# Altium schematic sheet wled-tube.SchDoc
size A3; DocumentNumber: 1; SheetNumber: 1; SheetTotal: 2
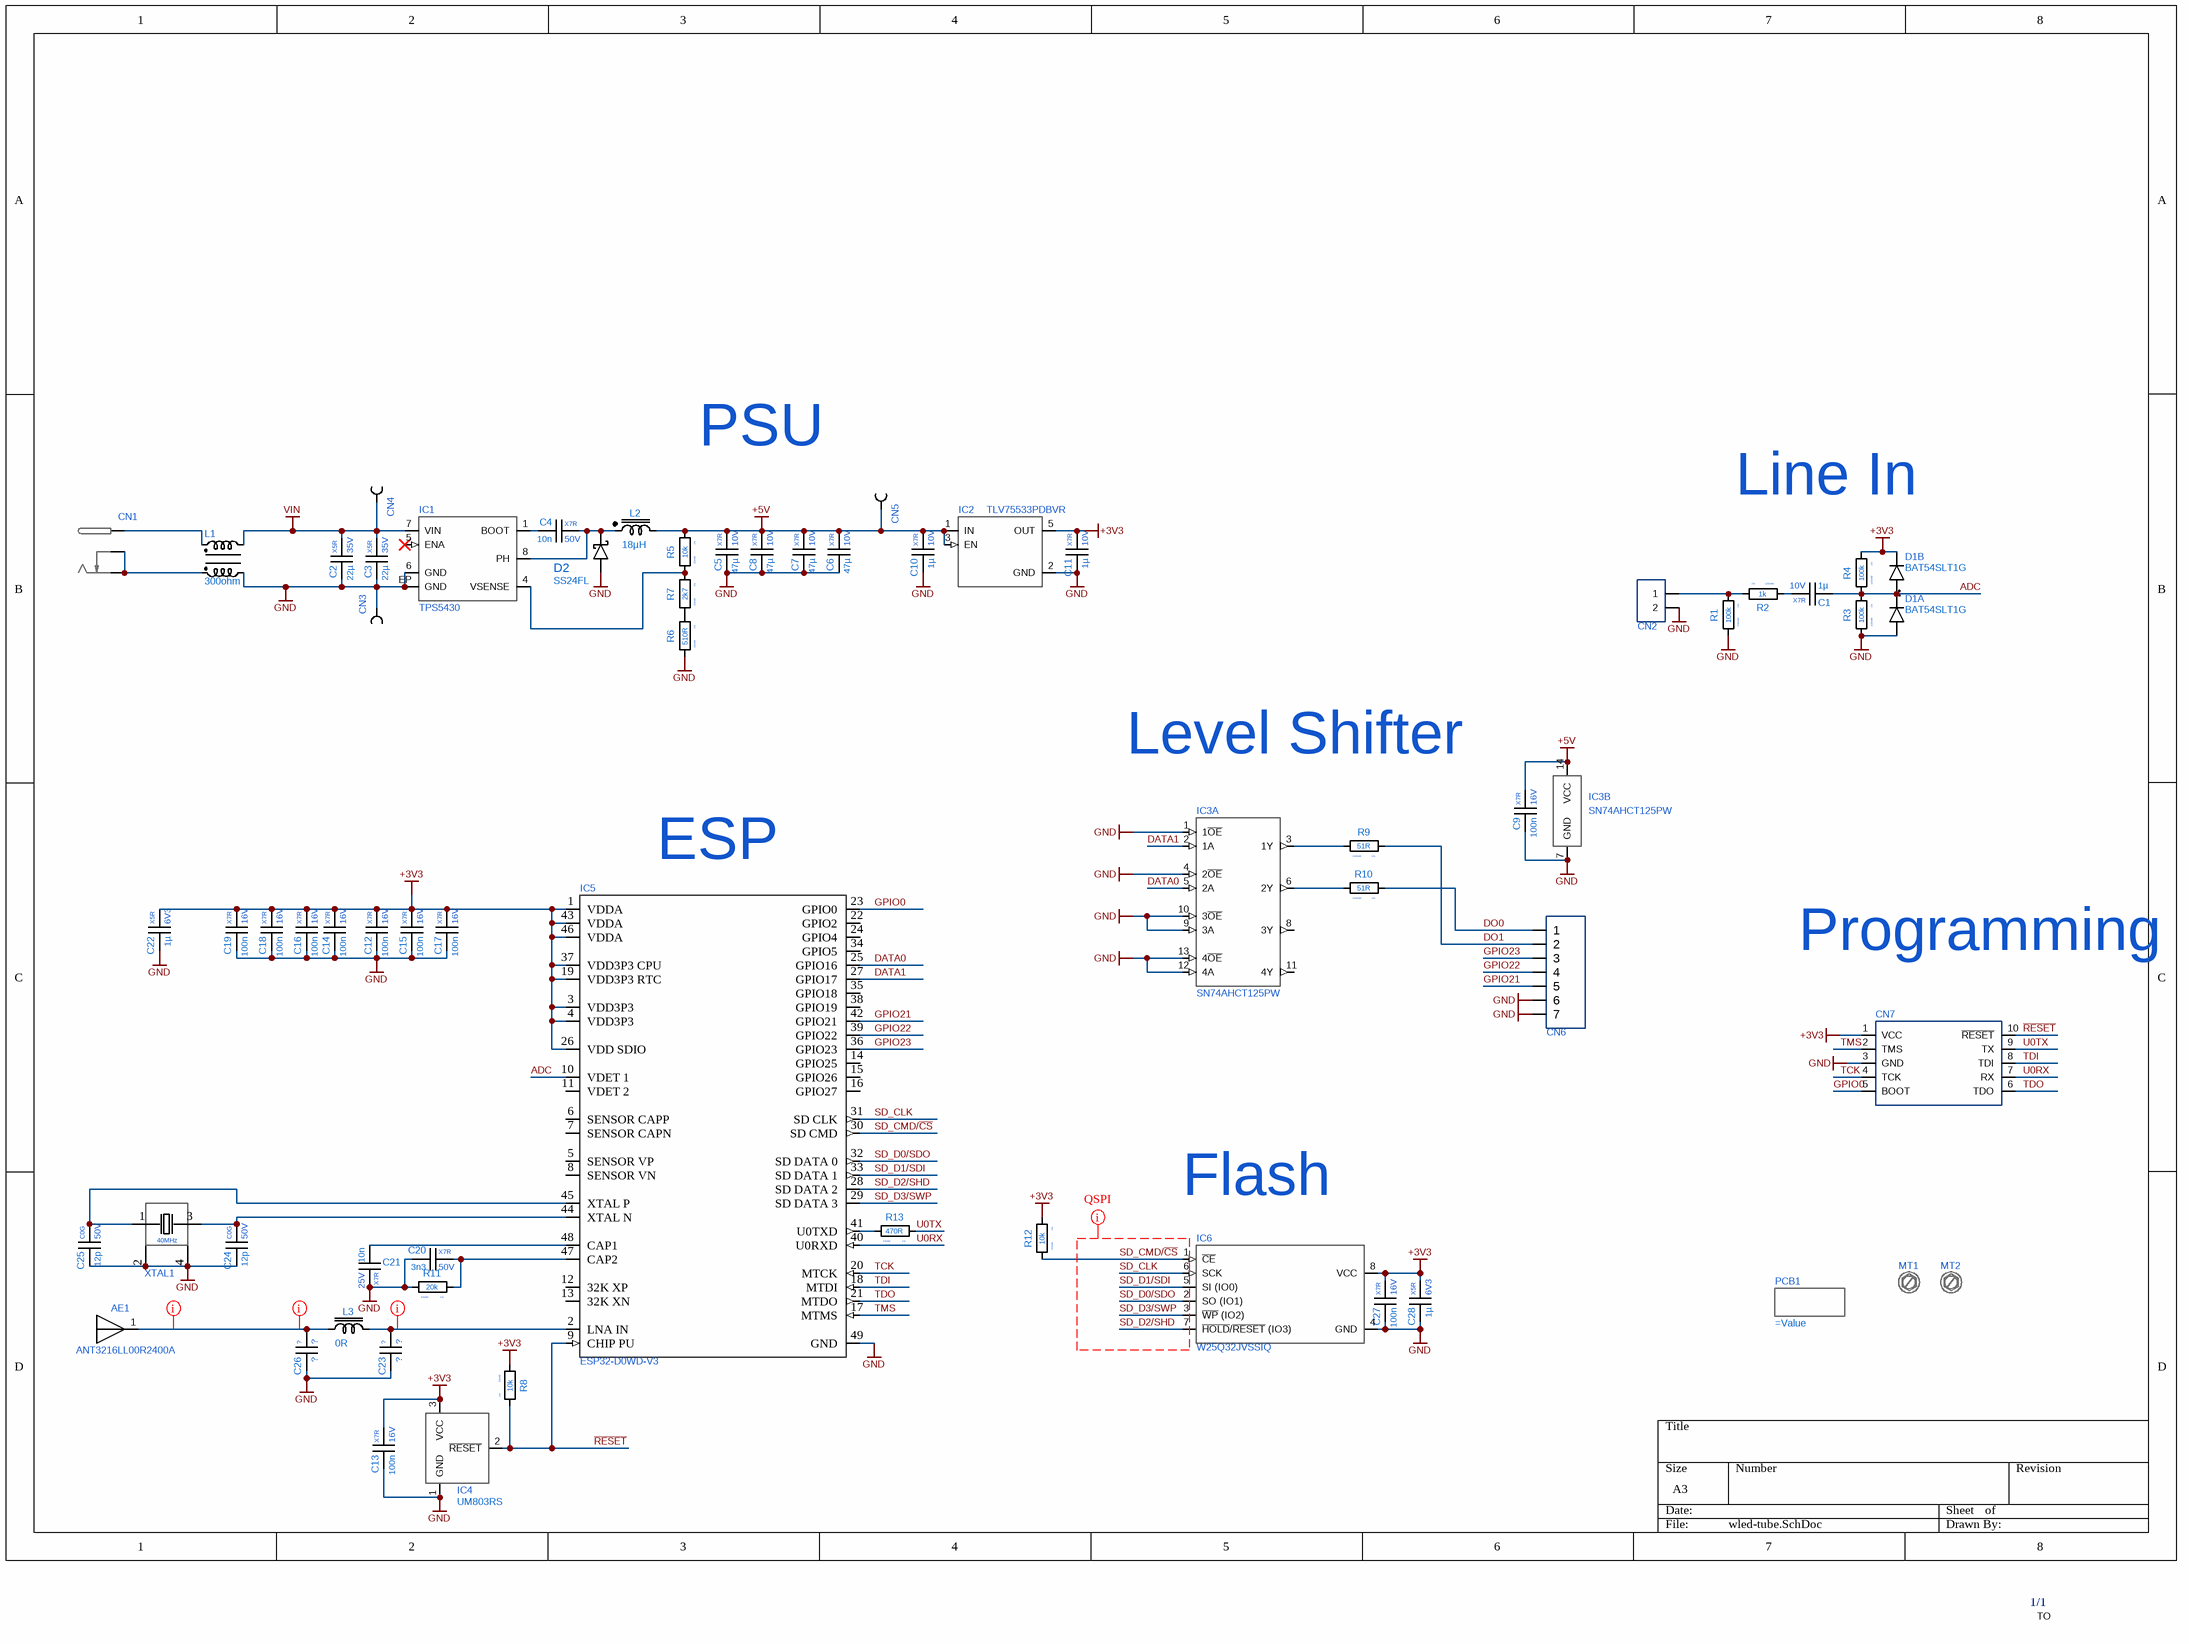
[diagram p0: wled-tube.SchDoc]

## Parts
AE1  ANT3216LL00R2400A  [1206-ANT]
C1  1µ  _P2: X7R  _P1: 10V  [0603-CAP]
C2  22µ  _P2: X5R  _P1: 35V  [1210-CAP]
C3  22µ  _P2: X5R  _P1: 35V  [1210-CAP]
C4  10n  _P2: X7R  _P1: 50V  [0603-CAP]
C5  47µ  _P2: X7R  _P1: 10V  [1210-CAP]
C6  47µ  _P2: X7R  _P1: 10V  [1210-CAP]
C7  47µ  _P2: X7R  _P1: 10V  [1210-CAP]
C8  47µ  _P2: X7R  _P1: 10V  [1210-CAP]
C9  100n  _P2: X7R  _P1: 16V  [0402-CAP]
C10  1µ  _P2: X7R  _P1: 10V  [0603-CAP]
C11  1µ  _P2: X7R  _P1: 10V  [0603-CAP]
C12  100n  _P2: X7R  _P1: 16V  [0402-CAP]
C13  100n  _P2: X7R  _P1: 16V  [0402-CAP]
C14  100n  _P2: X7R  _P1: 16V  [0402-CAP]
C15  100n  _P2: X7R  _P1: 16V  [0402-CAP]
C16  100n  _P2: X7R  _P1: 16V  [0402-CAP]
C17  100n  _P2: X7R  _P1: 16V  [0402-CAP]
C18  100n  _P2: X7R  _P1: 16V  [0402-CAP]
C19  100n  _P2: X7R  _P1: 16V  [0402-CAP]
C20  3n3  _P2: X7R  _P1: 50V  [0402-CAP]
C21  10n  _P2: X7R  _P1: 25V  [0402-CAP]
C22  1µ  _P2: X5R  _P1: 6V3  [0402-CAP]
C23  ?  [0402-CAP]
C24  12p  _P2: C0G  _P1: 50V  [0402-CAP]
C25  12p  _P2: C0G  _P1: 50V  [0402-CAP]
C26  ?  [0402-CAP]
C27  100n  _P2: X7R  _P1: 16V  [0402-CAP]
C28  1µ  _P2: X5R  _P1: 6V3  [0402-CAP]
CN1  (no value)  [DCJACK-1]
CN2  CON-HDR-MALE-2.54MM-1x2-VERT-THT  [CON-HDR-MALE-2.54MM-1x2-VERT-THT]  (value not drawn)
CN3  PAD1.3MM  [PAD1MM3]  (value not drawn)  (no BOM)
CN4  PAD1.3MM  [PAD1MM3]  (value not drawn)  (no BOM)
CN5  PAD1.3MM  [PAD1MM3]  (value not drawn)  (no BOM)
CN6  CON-HDR-MALE-2.54MM-1x7-VERT-THT  [CON-HDR-MALE-2.54MM-1x7-VERT-THT]  (value not drawn)
CN7  TC2050_RASE  [TC2050]  (value not drawn)  (no BOM)
D1  BAT54SLT1G  [SOT-23]  (parts A,B of 2)
D2  SS24FL  [SMAF]
IC1  TPS5430  [TPS5430]
IC2  TLV75533PDBVR  [SOT-23-5]
IC3  SN74AHCT125PW  [TSSOP14]  (parts A,B of 2)
IC4  UM803RS  [SOT-23]
IC5  ESP32-D0WD-V3  [ESP32-D0WD-V3]
IC6  W25Q32JVSSIQ  [SO-08L]
L1  300ohm  [COILCMACM7060]
L2  18µH  [COILSRN8040]
L3  0R  [0402-IND]
MT1  *  [SCRW3MM]  (value not drawn)  (no BOM)
MT2  *  [SCRW3MM]  (value not drawn)  (no BOM)
PCB1  (no value)  [PCB]
R1  100k  _P2: 1%  _P1: 100mW  [0603-RES]
R2  1k  _P2: 1%  _P1: 100mW  [0603-RES]
R3  100k  _P2: 1%  _P1: 100mW  [0603-RES]
R4  100k  _P2: 1%  _P1: 100mW  [0603-RES]
R5  10k  _P2: 1%  _P1: 63mW  [0402-RES]
R6  510R  _P2: 1%  _P1: 63mW  [0402-RES]
R7  2k7  _P2: 1%  _P1: 63mW  [0402-RES]
R8  10k  _P2: 1%  _P1: 63mW  [0402-RES]
R9  51R  _P2: 1%  _P1: 100mW  [0603-RES]
R10  51R  _P2: 1%  _P1: 100mW  [0603-RES]
R11  20k  _P2: 1%  _P1: 63mW  [0402-RES]
R12  10k  _P2: 1%  _P1: 63mW  [0402-RES]
R13  470R  _P2: 1%  _P1: 63mW  [0402-RES]
XTAL1  Frequency: 40MHz  [TSX-3225]  (hidden comment: TSX-3225 40.0000MF10Y-K0)

## Nets
+3V3: C11.2 C12.2 C13.2 C14.2 C15.2 C16.2 C17.2 C18.2 C19.2 C22.2 C27.2 C28.2 CN7.1(VCC) D1.2(K) IC2.5(OUT) IC4.3(VCC) IC5.1(VDDA) IC5.3(VDD3P3) IC5.4(VDD3P3) IC5.19(VDD3P3_RTC) IC5.26(VDD_SDIO) IC5.37(VDD3P3_CPU) IC5.43(VDDA) IC5.46(VDDA) IC6.8(VCC) R4.2 R8.1 R12.2
+5V: C5.2 C6.2 C7.2 C8.2 C9.2 C10.2 CN5.1 IC2.1(IN) IC2.3(EN) IC3.14(VCC) L2.2 R5.2
GND: C2.1 C3.1 C5.1 C6.1 C7.1 C8.1 C9.1 C10.1 C11.1 C12.1 C13.1 C14.1 C15.1 C16.1 C17.1 C18.1 C19.1 C20.1 C21.2 C22.1 C23.1 C24.1 C25.1 C26.1 C27.1 C28.1 CN2.2 CN3.1 CN6.6 CN6.7 CN7.3(GND) D1.1(A) D2.A IC1.6(GND) IC1.EP(GND) IC2.2(GND) IC3.1(1~{OE}) IC3.4(2~{OE}) IC3.7(GND) IC3.9(3A) IC3.10(3~{OE}) IC3.12(4A) IC3.13(4~{OE}) IC4.1(GND) IC5.49(GND) IC6.4(GND) L1.4 R1.1 R3.1 R6.1 R11.1 XTAL1.2(GND) XTAL1.4(GND)
VIN: C2.2 C3.2 CN4.1 IC1.7(VIN) L1.3
ADC: C1.1 D1.3(K) IC5.10(VDET_1) R3.2 R4.1
DATA0: IC3.5(2A) IC5.25(GPIO16)
DATA1: IC3.2(1A) IC5.27(GPIO17)
DO0: CN6.1 R10.2
DO1: CN6.2 R9.2
GPIO0: CN7.5(BOOT) IC5.23(GPIO0)
GPIO21: CN6.5 IC5.42(GPIO21)
GPIO22: CN6.4 IC5.39(GPIO22)
GPIO23: CN6.3 IC5.36(GPIO23)
~{RESET}: CN7.10(~{RESET}) IC4.2(~{RESET}) IC5.9(CHIP_PU) R8.2
SD_CLK: IC5.31(SD_CLK) IC6.6(SCK)
SD_CMD/~{CS}: IC5.30(SD_CMD) IC6.1(~{CE}) R12.1
SD_D0/SDO: IC5.32(SD_DATA_0) IC6.2(SO_(IO1))
SD_D1/SDI: IC5.33(SD_DATA_1) IC6.5(SI_(IO0))
SD_D2/SHD: IC5.28(SD_DATA_2) IC6.7(~{HOLD}/~{RESET}_(IO3))
SD_D3/SWP: IC5.29(SD_DATA_3) IC6.3(~{WP}_(IO2))
TCK: CN7.4(TCK) IC5.20(MTCK)
TDI: CN7.8(TDI) IC5.18(MTDI)
TDO: CN7.6(TDO) IC5.21(MTDO)
TMS: CN7.2(TMS) IC5.17(MTMS)
U0RX: CN7.7(RX) IC5.40(U0RXD)
U0TX: CN7.9(TX) R13.2
NetAE1_1: AE1.1 C26.2 L3.1
NetC1_2: C1.2 R2.1
NetC4_1: C4.1 IC1.1(BOOT)
NetC4_2: C4.2 D2.K IC1.8(PH) L2.1
NetC20_2: C20.2 IC5.47(CAP2) R11.2
NetC21_1: C21.1 IC5.48(CAP1)
NetC23_2: C23.2 IC5.2(LNA_IN) L3.2
NetC24_2: C24.2 IC5.44(XTAL_N) XTAL1.3(X2)
NetC25_2: C25.2 IC5.45(XTAL_P) XTAL1.1(X1)
NetCN1_1: CN1.1 L1.2
NetCN1_2: CN1.2 CN1.3 L1.1
NetCN2_1: CN2.1 R1.2 R2.2
NetIC1_4: IC1.4(VSENSE) R5.1 R7.2
NetIC3_3: IC3.3(1Y) R9.1
NetIC3_6: IC3.6(2Y) R10.1
NetIC5_41: IC5.41(U0TXD) R13.1
NetR6_2: R6.2 R7.1

Not connected (* = marked no-connect by the designer): IC1 5(ENA)*; IC3 8(3Y) 11(4Y); IC5 5(SENSOR_VP) 6(SENSOR_CAPP) 7(SENSOR_CAPN) 8(SENSOR_VN) 11(VDET_2) 12(32K_XP) 13(32K_XN) 14(GPIO25) 15(GPIO26) 16(GPIO27) 22(GPIO2) 24(GPIO4) 34(GPIO5) 35(GPIO18) 38(GPIO19)

## Layout directives
net class 50ohm: NetAE1_1, NetC23_2
net class QSPI: SD_CLK, SD_CMD/~{CS}, SD_D0/SDO, SD_D1/SDI, SD_D2/SHD, SD_D3/SWP

## Notes on the sheet
- PSU
- Line In
- Level Shifter
- (near IC5) ESP
- Programming
- (near IC6) Flash
- 1/1
- TO

## Library data of the parts
AE1 = ANT3216LL00R2400A: Ceramic chip antenna 2.4 GHz; Manufacturer: Yageo; UID: ANT3216LL00R2400A; Manufacturer Part Number: ANT3216LL00R2400A; Supplier 1: LCSC; Supplier Part Number 1: C293767; Datasheet: https://datasheet.lcsc.com/lcsc/1810241140_YAGEO-ANT3216LL00R2400A_C293767.pdf
C1 C10 C11 = CAP0603-1µ-10V-10%-X7R: CAP 0603 CERAMIC 1µ 10V ±10% X7R; UID: CAP0603-1µ-10V-10%-X7R; Value: 1µ; Voltage: 10V; Tolerance: 10%; Dielectric: X7R; Library path: NONPCAP.SchLib; Footprint path: 0603-CAP.PcbLib
C2 C3 = CAP1210-22µ-35V-10%-X5R: CAP 1210 CERAMIC 22µ 35V ±10% X5R; UID: CAP1210-22µ-35V-10%-X5R; Value: 22µ; Voltage: 35V; Tolerance: 10%; Dielectric: X5R; Library path: NONPCAP.SchLib; Footprint path: 1210-CAP.PcbLib
C4 = CAP0603-10n-50V-10%-X7R: CAP 0603 CERAMIC 10n 50V ±10% X7R; UID: CAP0603-10n-50V-10%-X7R; Value: 10n; Voltage: 50V; Tolerance: 10%; Dielectric: X7R; Library path: NONPCAP.SchLib; Footprint path: 0603-CAP.PcbLib
C5-C8 = CAP1210-47µ-10V-10%-X7R: CAP 1210 CERAMIC 47µ 10V ±10% X7R; UID: CAP1210-47µ-10V-10%-X7R; Value: 47µ; Voltage: 10V; Tolerance: 10%; Dielectric: X7R; Library path: NONPCAP.SchLib; Footprint path: 1210-CAP.PcbLib
C9 C12-C19 C27 = CAP0402-100n-16V-10%-X7R: CAP 0402 CERAMIC 100n 16V ±10% X7R; Tolerance: 10%; Voltage: 16V; Dielectric: X7R; UID: CAP0402-100n-16V-10%-X7R; Value: 100n; Library path: NONPCAP.SchLib; Footprint path: 0402-CAP.PcbLib
C20 = C0402-3n3-50V-X7R-10%: Cap SMT 0402 3n3 50V X7R ±10%; UID: C0402-3n3-50V-X7R-10%; Capacitance: 3n3; Voltage: 50V; Dielectric: X7R; Tolerance: 10%; Supplier 1: LCSC; Supplier Part Number 1: C26404
C21 = C0402-10n-25V-X7R-10%: Cap SMT 0402 10n 25V X7R ±10%; Capacitance: 10n; Voltage: 25V; Dielectric: X7R; UID: C0402-10n-25V-X7R-10%; Tolerance: 10%
C22 C28 = CAP0402-1µ-6V3-10%-X5R: CAP 0402 CERAMIC 1µ 6V3 ±10% X5R; Tolerance: 10%; Voltage: 6V3; Dielectric: X5R; UID: CAP0402-1µ-6V3-10%-X5R; Value: 1µ; Library path: NONPCAP.SchLib; Footprint path: 0402-CAP.PcbLib
C23 C26 = C0402-?-?-?-?%: Cap SMT 0402 ? ? ? ±?%; _P2: ?; _P1: ?; UID: C0402-?-?-?-?%; Capacitance: ?; Voltage: ?; Dielectric: ?; Tolerance: ?%
C24 C25 = C0402-12p-50V-C0G-5%: Cap SMT 0402 12p 50V C0G ±5%; UID: C0402-12p-50V-C0G-5%; Capacitance: 12p; Voltage: 50V; Dielectric: C0G; Tolerance: 5%
CN1 = DCJACK-1: DC Jack Lih Sheng LD-0202A 2.0mm; Manufacturer Part Number: LD-0202A-2.0; UID: DCJACK-1; Pin Count: 3; Manufacturer: Lih Sheng
CN2 = CON-HDR-MALE-2.54MM-1x2-VERT-THT: CONN HEADER VERT 2POS 2.54MM; Manufacturer Part Number: TSW-102-07-L-S; Manufacturer: Samtec Inc.; Pitch: 0.100" (2.54mm); Number of Positions: 2; Contact Length - Mating: 0.230" (5.84mm); Overall Contact Length: 0.430" (10.92mm); Material Flammability Rating: UL94 V-0; UID: CON-HDR-MALE-2.54MM-1x2-VERT-THT; Datasheets: http://suddendocs.samtec.com/prints/tsw-xxx-xx-x-x-xx-xxx-footprint.pdf; Supplier Part Number 1: SAM1031-02-ND; Supplier 1: Digi-Key; Series: TSW; Connector Type: Header; Contact Type: Male Pin; Number of Rows: 1; Mounting Type: Through Hole; Contact Length - Post: 0.100" (2.54mm); Insulation Height: 0.100" (2.54mm); Contact Finish - Mating: Gold; Contact Finish Thickness - Mating: 10.0µin (0.25µm); Contact Finish - Post: Tin; Operating Temperature: -55°C ~ 125°C
CN6 = CON-HDR-MALE-2.54MM-1x7-VERT-THT: CONN HEADER VERT 7POS 2.54MM; Manufacturer Part Number: TSW-107-07-L-S; Manufacturer: Samtec Inc.; Pitch: 0.100" (2.54mm); Number of Positions: 7; Contact Length - Mating: 0.230" (5.84mm); Overall Contact Length: 0.430" (10.92mm); Material Flammability Rating: UL94 V-0; UID: CON-HDR-MALE-2.54MM-1x7-VERT-THT; Datasheets: http://suddendocs.samtec.com/catalog_english/tsw_th.pdf; Supplier Part Number 1: SAM1031-07-ND; Supplier 1: Digi-Key; Series: TSW; Connector Type: Header; Contact Type: Male Pin; Number of Rows: 1; Mounting Type: Through Hole; Contact Length - Post: 0.100" (2.54mm); Insulation Height: 0.100" (2.54mm); Contact Finish - Mating: Gold; Contact Finish Thickness - Mating: 10.0µin (0.25µm); Contact Finish - Post: Tin; Operating Temperature: -55°C ~ 125°C
CN7 = TC2050_RASE: Solderless programming connector, mates with Tag-Connect TC2050; UID: TC2050_RASE; Manufacturer Part Number: -
D1 = BAT54SLT1G: BAT54SLT1G Dual 30V 200mA Schottky Diode; Manufacturer: ON Semiconductor; UID: BAT54SLT1G; Supplier 1: Digi-Key; Supplier Part Number 1: BAT54SLT1GOSTR-ND; Manufacturer Part Number: BAT54SLT1G; Series: BAT54; Library path: BAT54SLT1G.SchLib; Footprint path: SOT-23.PcbLib; Category: DIODE
D2 = SS24FL: 40V 550mV@2A 2A SMAF Schottky Barrier Diodes (SBD) ROHS; Manufacturer: Shikues; UID: SS24FL; Manufacturer Part Number: SS24FL; Supplier 1: LCSC; Supplier Part Number 1: C111630; Datasheet: https://datasheet.lcsc.com/lcsc/1809211222_Shikues-SS24FL_C111630.pdf
IC1 = TPS5430: Step-down type SO-8 DC-DC Converters ROHS; Manufacturer Part Number: TPS5430DDAR; Manufacturer: TI; UID: TPS5430; Supplier 1: LCSC; Supplier Part Number 1: C9864; Datasheet: http://www.ti.com/cn/lit/gpn/tps5430
IC2 = TLV75533PDBVR: Manufacturer: TI; UID: TLV75533PDBVR; Category: Regulator; Manufacturer Part Number: TLV75533PDBVR
IC3 = SN74AHCT125PW: Quad buffer, TSSOP14; Manufacturer: Texas Instruments; Manufacturer Part Number: SN74AHCT125PWR; UID: SN74AHCT125PW
IC4 = UM803RS: MICROPROCESSOR RESET CIRCUIT 2.63V SOT23; UID: UM803RS; Category: IC SUPERVISOR
IC5 = ESP32-D0WD-V3: IC RF TxRx + MCU Bluetooth, WiFi 802.11b/g/n, Bluetooth 4.2 2.412GHz ~ 2.484GHz 48-VFQFN Exposed Pad; Manufacturer: Espressif; UID: ESP32-D0WD-V3; Manufacturer Part Number: ESP32-D0WD-V3; Supplier 1: Digi-Key; Supplier Part Number 1: 1904-ESP32-D0WD-V3CT-ND; Datasheet: http://espressif.com/sites/default/files/documentation/esp32_datasheet_en.pdf
IC6 = W25Q32JVSSIQ: 3V 32M-BIT SERIAL FLASH MEMORY WITH DUAL/QUAD SPI, QPI & DTR; Manufacturer: Winbond; UID: W25Q32JVSSIQ; Value: W25Q32JVSSIQ; Manufacturer Part Number: W25Q32JVSSIQ
L1 = COILCM7060-301: TDK ACM7060 / Sunltech Tech SMW7060 / Shun Xiang Nuo Elec SMCM7060; Manufacturer: TDK, Sunltech, Shun Xiang Nuo Elec; Manufacturer Part Number: ACM7060-301-2PL-TL01, SMW7060S301NTT, SMCM7060-301T; UID: COILCM7060-301; Category: CMC SMT; Value: 300ohm
L2 = SMNR8040-180MT: 18uH, 68mOhm(max), 2.7A(sat), 2.4A(DC); Manufacturer: SXN; UID: SMNR8040-180MT; Category: INDUCTOR SMT; Value: 18µH; Supplier 1: LCSC; Supplier Part Number 1: C467157; Manufacturer Part Number: SMNR8040-180MT; Current Rating: 2.7A(sat), 2.4A(DC); DC Resistance: 68mOhm
L3 = L0402-?-?%: Inductor SMT ? ±?%; UID: L0402-?-?%; Value: ?; Tolerance: ?%; Composition: Wirewound
MT1 MT2 = SCRW-3MMISO: UID: SCRW-3MMISO; Pin Count: 1
PCB1 = PCB: See PCB gerber files for specifications.; UID: PCB; Value: =ModelName+'_'+Rev
R1 R3 R4 = RES-0603-100k-100mW-1%-THICKFILM: RES SMD 100K OHM 1% 1/10W 0603; Manufacturer Part Number: RC0603FR-07100KL; Manufacturer: Yageo; Temperature Coefficient: ±100ppm/°C; _P3: Thick Film; UID: RES-0603-100k-100mW-1%-THICKFILM; Datasheets: http://www.yageo.com/NewPortal/yageodocoutput?fileName=/pdf/R-Chip/PYu-RC_Group_51_RoHS_L_4.pdf; Supplier 1: Digi-Key; Supplier Part Number 1: 311-100KHRCT-ND; Series: RC; Value: 100k; Tolerance: 1%; Power: 100mW; Composition: Thick Film; Features: Moisture Resistant; Operating Temperature: -55°C ~ 155°C; Package / Case: 0603 (1608 Metric); Dimensions: 0.063" L x 0.031" W (1.60mm x 0.80mm); Height: 0.022" (0.55mm)
R2 = RES-0603-1k-100mW-1%-THICKFILM: RES SMD 1K OHM 1% 1/10W 0603; Manufacturer Part Number: RC0603FR-071KL; Manufacturer: Yageo; Temperature Coefficient: ±100ppm/°C; _P3: Thick Film; UID: RES-0603-1k-100mW-1%-THICKFILM; Datasheets: http://www.yageo.com/NewPortal/yageodocoutput?fileName=/pdf/R-Chip/PYu-RC_Group_51_RoHS_L_4.pdf; Supplier 1: Digi-Key; Supplier Part Number 1: 311-1.00KHRCT-ND; Series: RC; Value: 1k; Tolerance: 1%; Power: 100mW; Composition: Thick Film; Features: Moisture Resistant; Operating Temperature: -55°C ~ 155°C; Package / Case: 0603 (1608 Metric); Dimensions: 0.063" L x 0.031" W (1.60mm x 0.80mm); Height: 0.022" (0.55mm)
R5 R8 R12 = RES-0402-10k-63mW-1%-THICKFILM: RES SMD 10K OHM 1% 1/16W 0402; Manufacturer Part Number: RC0402FR-0710KL; Manufacturer: Yageo; Temperature Coefficient: ±100ppm/°C; _P3: Thick Film; UID: RES-0402-10k-63mW-1%-THICKFILM; Datasheets: https://www.yageo.com/upload/media/product/productsearch/datasheet/rchip/PYu-RC_Group_51_RoHS_L_11.pdf; Supplier 1: Digi-Key; Supplier Part Number 1: 311-10.0KLRCT-ND; Series: RC_L; Value: 10k; Tolerance: 1%; Power: 63mW; Composition: Thick Film; Features: Moisture Resistant; Operating Temperature: -55°C ~ 155°C; Package / Case: 0402 (1005 Metric); Size / Dimension: 0.039" L x 0.020" W (1.00mm x 0.50mm); Height - Seated (Max): 0.016" (0.40mm)
R6 = RES-0402-510R-63mW-1%-THICKFILM: RES SMD 510 OHM 1% 1/16W 0402; Manufacturer Part Number: RC0402FR-07510RL; Manufacturer: Yageo; Temperature Coefficient: ±100ppm/°C; _P3: Thick Film; UID: RES-0402-510R-63mW-1%-THICKFILM; Datasheets: https://www.yageo.com/upload/media/product/productsearch/datasheet/rchip/PYu-RC_Group_51_RoHS_L_11.pdf; Supplier Part Number 1: 311-510LRCT-ND; Supplier 1: Digi-Key; Series: RC_L; Value: 510R; Tolerance: 1%; Power: 63mW; Composition: Thick Film; Features: Moisture Resistant; Operating Temperature: -55°C ~ 155°C; Package / Case: 0402 (1005 Metric); Size / Dimension: 0.039" L x 0.020" W (1.00mm x 0.50mm); Height - Seated (Max): 0.016" (0.40mm)
R7 = RES-0402-2k7-63mW-1%-THICKFILM: RES SMD 2.7K OHM 1% 1/16W 0402; Manufacturer Part Number: RC0402FR-072K7L; Manufacturer: Yageo; Temperature Coefficient: ±100ppm/°C; _P3: Thick Film; UID: RES-0402-2k7-63mW-1%-THICKFILM; Datasheets: https://www.yageo.com/upload/media/product/productsearch/datasheet/rchip/PYu-RC_Group_51_RoHS_L_11.pdf; Supplier Part Number 1: 311-2.70KLRCT-ND; Supplier 1: Digi-Key; Series: RC_L; Value: 2k7; Tolerance: 1%; Power: 63mW; Composition: Thick Film; Features: Moisture Resistant; Operating Temperature: -55°C ~ 155°C; Package / Case: 0402 (1005 Metric); Size / Dimension: 0.039" L x 0.020" W (1.00mm x 0.50mm); Height - Seated (Max): 0.016" (0.40mm)
R9 R10 = RES-0603-51R-100mW-1%-THICKFILM: RES SMD 51 OHM 1% 1/10W 0603; Manufacturer Part Number: RC0603FR-0751RL; Manufacturer: Yageo; Temperature Coefficient: ±100ppm/°C; _P3: Thick Film; UID: RES-0603-51R-100mW-1%-THICKFILM; Datasheets: http://www.yageo.com/NewPortal/yageodocoutput?fileName=/pdf/R-Chip/PYu-RC_Group_51_RoHS_L_4.pdf; Supplier 1: Digi-Key; Supplier Part Number 1: 311-51.0HRCT-ND; Series: RC; Value: 51R; Tolerance: 1%; Power: 100mW; Composition: Thick Film; Features: Moisture Resistant; Operating Temperature: -55°C ~ 155°C; Package / Case: 0603 (1608 Metric); Dimensions: 0.063" L x 0.031" W (1.60mm x 0.80mm); Height: 0.022" (0.55mm)
R11 = RES-0402-20k-63mW-1%-THICKFILM: RES SMD 20K OHM 1% 1/16W 0402; Manufacturer Part Number: RC0402FR-0720KL; Manufacturer: Yageo; Temperature Coefficient: ±100ppm/°C; _P3: Thick Film; UID: RES-0402-20k-63mW-1%-THICKFILM; Datasheets: https://www.yageo.com/upload/media/product/productsearch/datasheet/rchip/PYu-RC_Group_51_RoHS_L_11.pdf; Supplier Part Number 1: 311-20.0KLRCT-ND; Supplier 1: Digi-Key; Series: RC_L; Value: 20k; Tolerance: 1%; Power: 63mW; Composition: Thick Film; Features: Moisture Resistant; Operating Temperature: -55°C ~ 155°C; Package / Case: 0402 (1005 Metric); Size / Dimension: 0.039" L x 0.020" W (1.00mm x 0.50mm); Height - Seated (Max): 0.016" (0.40mm)
R13 = RES-0402-470R-63mW-1%-THICKFILM: RES SMD 470 OHM 1% 1/16W 0402; Manufacturer Part Number: RC0402FR-07470RL; Manufacturer: Yageo; Temperature Coefficient: ±100ppm/°C; _P3: Thick Film; UID: RES-0402-470R-63mW-1%-THICKFILM; Datasheets: https://www.yageo.com/upload/media/product/productsearch/datasheet/rchip/PYu-RC_Group_51_RoHS_L_11.pdf; Supplier Part Number 1: 311-470LRCT-ND; Supplier 1: Digi-Key; Series: RC_L; Value: 470R; Tolerance: 1%; Power: 63mW; Composition: Thick Film; Features: Moisture Resistant; Operating Temperature: -55°C ~ 155°C; Package / Case: 0402 (1005 Metric); Size / Dimension: 0.039" L x 0.020" W (1.00mm x 0.50mm); Height - Seated (Max): 0.016" (0.40mm)
XTAL1 = TSX-3225 40.0000MF10Y-K0: CRYSTAL 40.0000MHZ 10PF SMD; Manufacturer: EPSON; Value: 40MHz; Frequency Stability: ±10ppm; ESR (Equivalent Series Resistance): 40 Ohms; Operating Mode: Fundamental; UID: TSX-3225 40.0000MF10Y-K0; Datasheet: https://support.epson.biz/td/api/doc_check.php?dl=brief_TSX-3225&lang=en; Supplier Part Number 1: TSX-322540.0000MF10Y-K0-ND; Manufacturer Part Number: TSX-3225 40.0000MF10Y-K0; Supplier 1: Digi-Key; Series: TSX-3225; Type: MHz Crystal; Frequency Tolerance: ±10ppm; Load Capacitance: 10pF; Operating Temperature: -30°C ~ 85°C; Ratings: -; Mounting Type: Surface Mount; Package / Case: 4-SMD, No Lead; Size / Dimension: 0.126"" L x 0.098"" W (3.20mm x 2.50mm); Height - Seated (Max): 0.024"" (0.60mm)
CN3-CN5 = PAD1.3MM: UID: PAD1.3MM; Supplier 1: Digi-Key